# Altium schematic sheet Sheet2.SchDoc
size D
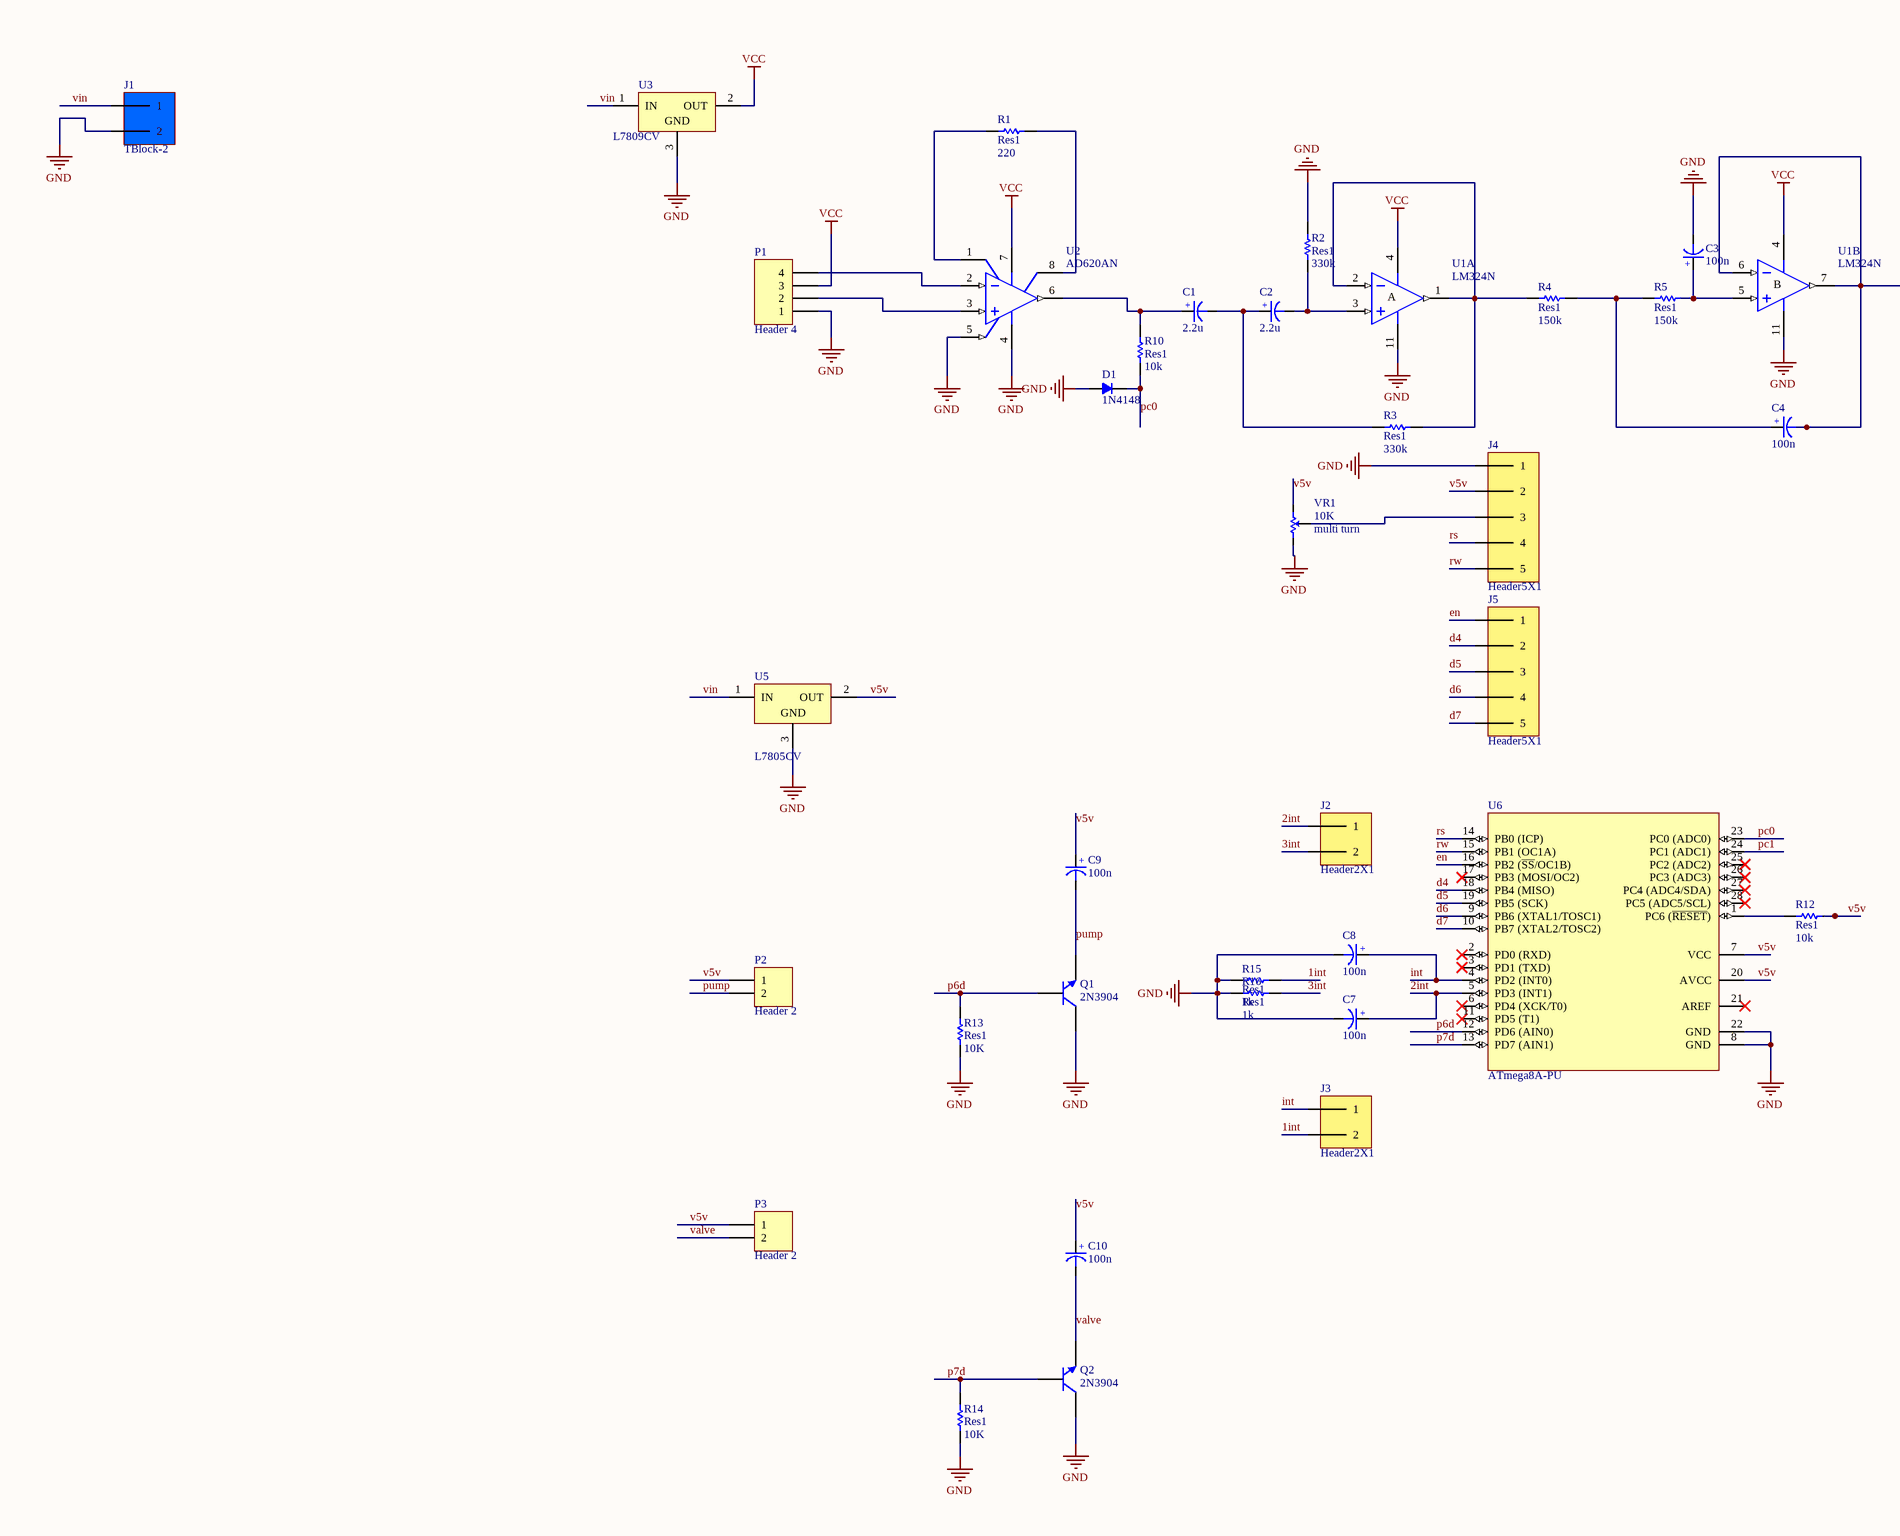
[diagram p0: Sheet2.SchDoc, left]
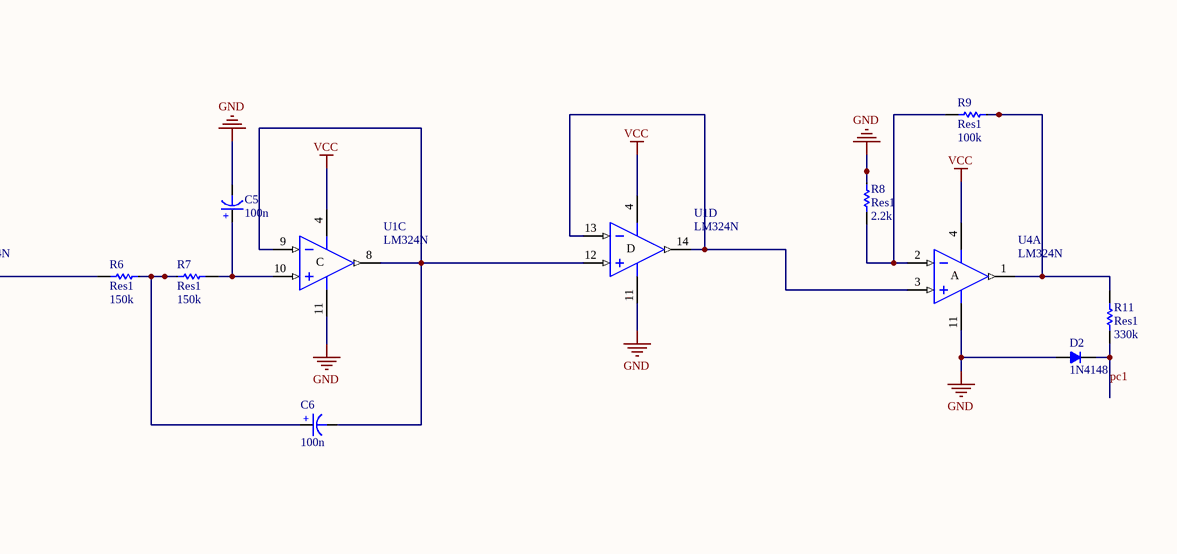
[diagram p1: Sheet2.SchDoc, right]

## Parts
C1  2.2u  [ELEC-CAP-RAD10-20]
C2  2.2u  [ELEC-CAP-RAD10-20]
C3  100n  [ELEC-CAP-RAD10-20]
C4  100n  [ELEC-CAP-RAD10-20]
C5  100n  [ELEC-CAP-RAD10-20]
C6  100n  [ELEC-CAP-RAD10-20]
C7  100n  [ELEC-CAP-RAD10-20]
C8  100n  [ELEC-CAP-RAD10-20]
C9  100n  [ELEC-CAP-RAD10-20]
C10  100n  [ELEC-CAP-RAD10-20]
D1  MODEL: 1N4148  [DO-41]  (hidden comment: MODEL)
D2  MODEL: 1N4148  [DO-41]  (hidden comment: MODEL)
J1  TBlock-2  [KF300-2 PIN]
J2  Header2X1  [Header 2X1]
J3  Header2X1  [Header 2X1]
J4  Header5X1  [HEADER 5X1]
J5  Header5X1  [HEADER 5X1]
P1  Header 4  [HDR1X4]
P2  Header 2  [HDR1X2]
P3  Header 2  [HDR1X2]
Q1  2N3904  [TO-92A]
Q2  2N3904  [TO-92A]
R1  Res1  value 220  [AXIAL-0.3]
R2  Res1  value 330k  [AXIAL-0.3]
R3  Res1  value 330k  [AXIAL-0.3]
R4  Res1  value 150k  [AXIAL-0.3]
R5  Res1  value 150k  [AXIAL-0.3]
R6  Res1  value 150k  [AXIAL-0.3]
R7  Res1  value 150k  [AXIAL-0.3]
R8  Res1  value 2.2k  [AXIAL-0.3]
R9  Res1  value 100k  [AXIAL-0.3]
R10  Res1  value 10k  [AXIAL-0.3]
R11  Res1  value 330k  [AXIAL-0.3]
R12  Res1  value 10k  [AXIAL-0.3]
R13  Res1  value 10K  [AXIAL-0.3]
R14  Res1  value 10K  [AXIAL-0.3]
R15  Res1  value 1k  [AXIAL-0.3]
R16  Res1  value 1k  [AXIAL-0.3]
U1  LM324N  [DIP14]  (parts A,B,C,D of 4)
U2  AD620AN  [N-8]
U3  L7809CV  [TO220ABN]
U4  LM324N  [DIP14]  (part A of 4)
U5  L7805CV  [TO220ABN]
U6  ATmega8A-PU  [28P3]
VR1  10K  [Multi Turn]

## Nets
GND: C3.1(-) C5.1(-) C7.1(-) C8.1(-) D1.1(A) D2.1(A) J1.2 J4.1 P1.1 Q1.3(C) Q2.3(C) R2.2 R8.1 R13.1 R14.1 R15.2 R16.2 U1.11(V-) U2.4(V-) U2.5(REF) U3.3(GND) U4.11(V-) U5.3(GND) U6.8(GND) U6.22(GND) VR1.1(CCW)
VCC: P1.3 U1.4(V+) U2.7(V+) U3.2(OUT) U4.4(V+)
1int: J3.2 R15.1
2int: C7.2(+) J2.1 U6.5(PD3_(INT1))
3int: J2.2 R16.1
d4: J5.2 U6.18(PB4_(MISO))
d5: J5.3 U6.19(PB5_(SCK))
d6: J5.4 U6.9(PB6_(XTAL1/TOSC1))
d7: J5.5 U6.10(PB7_(XTAL2/TOSC2))
en: J5.1 U6.16(PB2_(~{SS}/OC1B))
int: C8.2(+) J3.1 U6.4(PD2_(INT0))
p6d: Q1.2(B) R13.2 U6.12(PD6_(AIN0))
p7d: Q2.2(B) R14.2 U6.13(PD7_(AIN1))
pc0: D1.2(K) R10.1 U6.23(PC0_(ADC0))
pc1: D2.2(K) R11.1 U6.24(PC1_(ADC1))
pump: C9.1(-) P2.2 Q1.1(E)
rs: J4.4 U6.14(PB0_(ICP))
rw: J4.5 U6.15(PB1_(OC1A))
v5v: C9.2(+) C10.2(+) J4.2 P2.1 P3.1 R12.1 U5.2(OUT) U6.7(VCC) U6.20(AVCC) VR1.3(CW)
valve: C10.1(-) P3.2 Q2.1(E)
vin: J1.1 U3.1(IN) U5.1(IN)
NetC1_1: C1.1(-) C2.2(+) R3.2
NetC1_2: C1.2(+) R10.2 U2.6(OUT)
NetC2_1: C2.1(-) R2.1 U1.3(IN+)
NetC3_2: C3.2(+) R5.1 U1.5(IN+)
NetC4_1: C4.1(-) R6.2 U1.6(IN-) U1.7(OUT)
NetC4_2: C4.2(+) R4.1 R5.2
NetC5_2: C5.2(+) R7.1 U1.10(IN+)
NetC6_1: C6.1(-) U1.8(OUT) U1.9(IN-) U1.12(IN+)
NetC6_2: C6.2(+) R6.1 R7.2
NetJ4_3: J4.3 VR1.2(Setpoint)
NetP1_2: P1.2 U2.3(+IN)
NetP1_4: P1.4 U2.2(-IN)
NetR1_1: R1.1 U2.1(RG)
NetR1_2: R1.2 U2.8(RG)
NetR3_1: R3.1 R4.2 U1.1(OUT) U1.2(IN-)
NetR8_2: R8.2 R9.2 U4.2(IN-)
NetR9_1: R9.1 R11.2 U4.1(OUT)
NetR12_2: R12.2 U6.1(PC6_(~{RESET}))
NetU1_13: U1.13(IN-) U1.14(OUT) U4.3(IN+)

Not connected (* = marked no-connect by the designer): U6 2(PD0_(RXD))* 3(PD1_(TXD))* 6(PD4_(XCK/T0))* 11(PD5_(T1))* 17(PB3_(MOSI/OC2))* 21(AREF)* 25(PC2_(ADC2))* 26(PC3_(ADC3))* 27(PC4_(ADC4/SDA))* 28(PC5_(ADC5/SCL))*

## Notes on the sheet
- (in symbol LM324N, part A) A
- (in symbol LM324N, part B) B
- (in symbol LM324N, part C) C
- (in symbol LM324N, part D) D

## Library data of the parts
C1-C10 = Capacitor Electrolytic: Electrolytic Capacitor
D1 D2 = Diode
P1 = Header 4: Header, 4-Pin; LatestRevisionDate: 17-Jul-2002; LatestRevisionNote: Re-released for DXP Platform.; Publisher: Altium Limited
P2 P3 = Header 2: Header, 2-Pin; LatestRevisionDate: 17-Jul-2002; LatestRevisionNote: Re-released for DXP Platform.; Publisher: Altium Limited
Q1 Q2 = 2N3904: NPN General Purpose Amplifier; Published: 8-Jun-2000; LatestRevisionDate: 15-Jan-2003; LatestRevisionNote: PCB Footprint 'BCY-W3/D4.7' replaced; DatasheetVersion: 1997; PackageVersion: Sep-1998; PackageReference: TO-92A; Publisher: Altium Limited; PackageDescription: TO, Flat Index; 3 In-Line, Axial Leads; Body Dia. 4.5mm; Leads 0.51 x 0.48 mm (max); ComponentLink1Description: Manufacturer Link; ComponentLink1URL: http://www.fairchildsemi.com/; ComponentLink2Description: Datasheet; ComponentLink2URL: http://www.fairchildsemi.com/ds/2N%2F2N3904.pdf
R1-R16 = Res1: Resistor; Published: 8-Jun-2000; LatestRevisionDate: 17-Jul-2002; LatestRevisionNote: Re-released for DXP Platform.; PackageReference: AXIAL-0.3; Publisher: Altium Limited; PackageDescription: Axial Device, Thru-Hole; 2 Leads; 0.3 in Pin Spacing
U1 U4 = LM324N: Low-Power Quad Operational Amplifier; Published: 24-Aug-2001; LatestRevisionDate: 06-Jun-2005; LatestRevisionNote: Stylized 3D Model Added.; DatasheetVersion: Jun-1999; PackageVersion: Jan-1997; PackageReference: DIP14; Publisher: Altium Limited; PackageDescription: DIP; 14 Leads; Row Spacing 7.62 mm; Pitch 2.54 mm; ComponentLink1Description: Manufacturer Link; ComponentLink1URL: http://www.st.com/; ComponentLink2Description: Datasheet; ComponentLink2URL: http://www.st.com/stonline/products/literature/ds/2156/lm324.pdf
U2 = AD620AN: Low-Cost, Low-Power Instrumentation Amplifier; Published: 8-Jun-2000; LatestRevisionDate: 04-Mar-2005; LatestRevisionNote: Stylized 3D Model Added.; DatasheetVersion: REV.D 1998; PackageVersion: revA; PackageReference: N-8; Publisher: Altium Limited; PackageDescription: DIP; 8 Leads; Row Spacing 7.62 mm; Pitch 2.54 mm; ComponentLink1Description: Manufacturer Link; ComponentLink1URL: http://www.analog.com/en/prod/0%2C2877%2CAD620%2C00.html; ComponentLink2Description: Datasheet; ComponentLink2URL: http://www.analog.com/UploadedFiles/Data_Sheets/897653854AD620_g.pdf
U3 = L7809CV: Positive Voltage Regulator; Note: Tab is connected to pin 3 (GND).; Published: 24-Aug-2001; LatestRevisionDate: 17-Jul-2002; LatestRevisionNote: Re-released for DXP Platform.; DatasheetVersion: Dec-1998; PackageVersion: Jun-1998; PackageReference: TO220ABN; Publisher: Altium Limited; PackageDescription: TO, Thru-Hole, Vertical, Heatsink Mounted; 3 In-Line Leads; Pitch 2.54 mm; Pin sequence 1, 3, 2; ComponentLink1Description: Manufacturer Link; ComponentLink1URL: http://www.st.com/
U5 = L7805CV: Positive Voltage Regulator; Note: Tab is connected to pin 3 (GND).; Published: 24-Aug-2001; LatestRevisionDate: 17-Jul-2002; LatestRevisionNote: Re-released for DXP Platform.; DatasheetVersion: Dec-1998; PackageVersion: Jun-1998; PackageReference: TO220ABN; Publisher: Altium Limited; PackageDescription: TO, Thru-Hole, Vertical, Heatsink Mounted; 3 In-Line Leads; Pitch 2.54 mm; Pin sequence 1, 3, 2; ComponentLink1Description: Manufacturer Link; ComponentLink1URL: http://www.st.com/
U6 = ATmega8A-PU: 8-bit AVR Microcontroller, 8KB Flash, 512 Bytes EEPROM, 1KB SRAM, 28-pin PDIP, Industrial Grade (-40°C to 85°C); Published: 1-Apr-2010; DatasheetVersion: revC, Jul-2009; PackageVersion: revB, Sep-2001; PackageReference: 28P3; Publisher: Altium Limited; PackageDescription: 28-lead (0.300"/7.62mm Wide) Plastic Dual Inline Package (PDIP); Supplier 1: Digi-Key; Supplier Part Number 1: ATMEGA8A-PU-ND; Supplier 2: Farnell; Supplier Part Number 2: 1748534; Supplier 3: Mouser; Supplier Part Number 3: 556-ATMEGA8A-PU; ComponentLink1Description: Manufacturer Link; ComponentLink1URL: http://www.atmel.com/products/avr/default.asp?; ComponentLink2Description: ATmega8A Datasheet; ComponentLink2URL: http://www.atmel.com/dyn/resources/prod_documents/doc8159.pdf; ComponentLink3Description: ATmega8A Summary; ComponentLink3URL: http://www.atmel.com/dyn/resources/prod_documents/8159S.pdf; ComponentLink4Description: Atmel.com Home; ComponentLink4URL: http://www.atmel.com
VR1 = Resistor Variable: Variable Resistor; Value: 10K; Type: multi turn